# Altium schematic sheet Sheet1.SchDoc
size A2; SheetNumber: 1; SheetTotal: 1
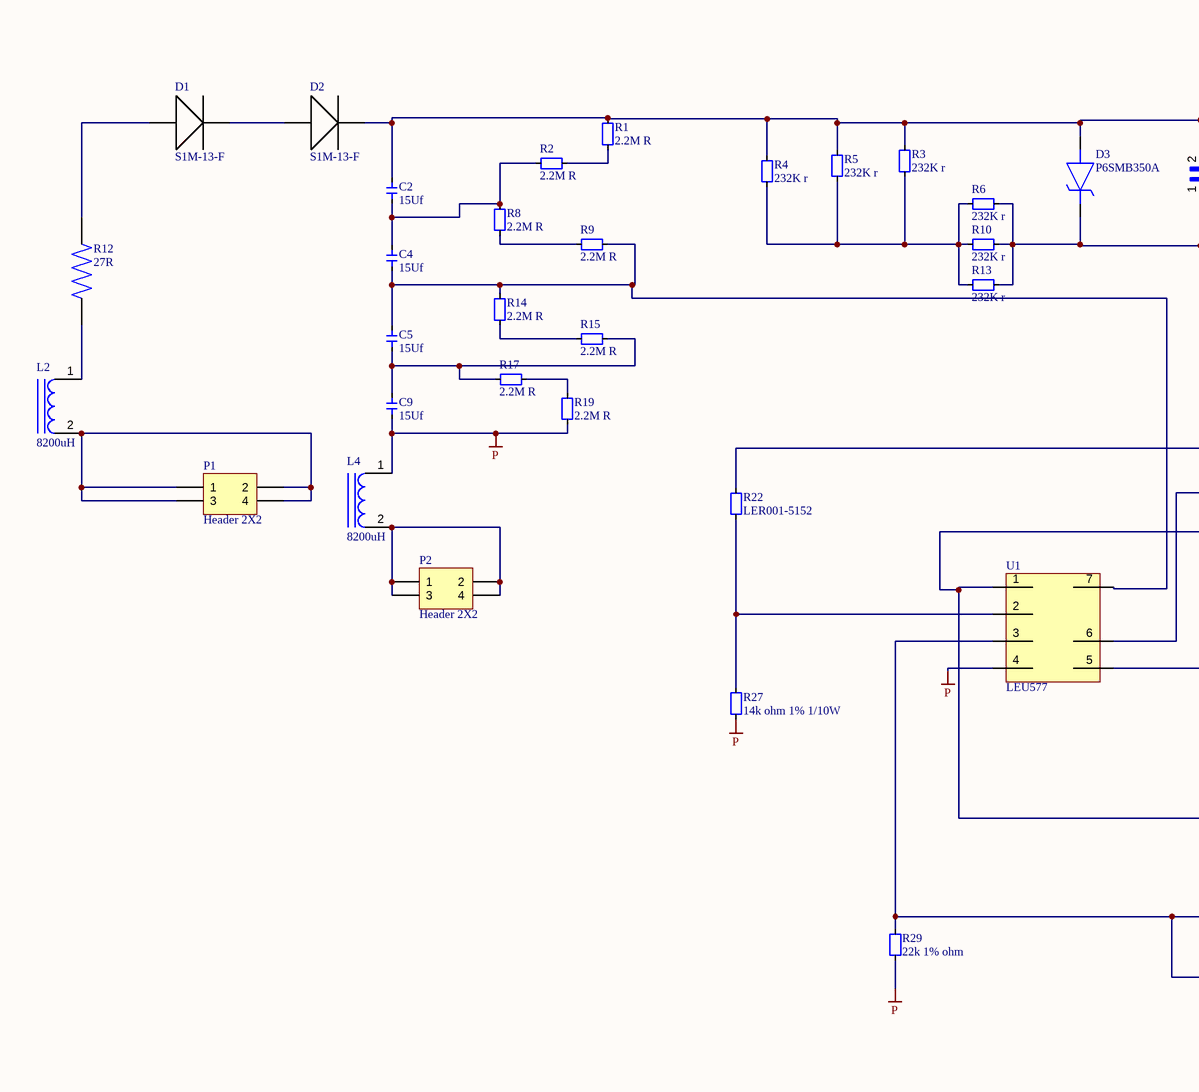
[diagram p0: Sheet1.SchDoc, left]
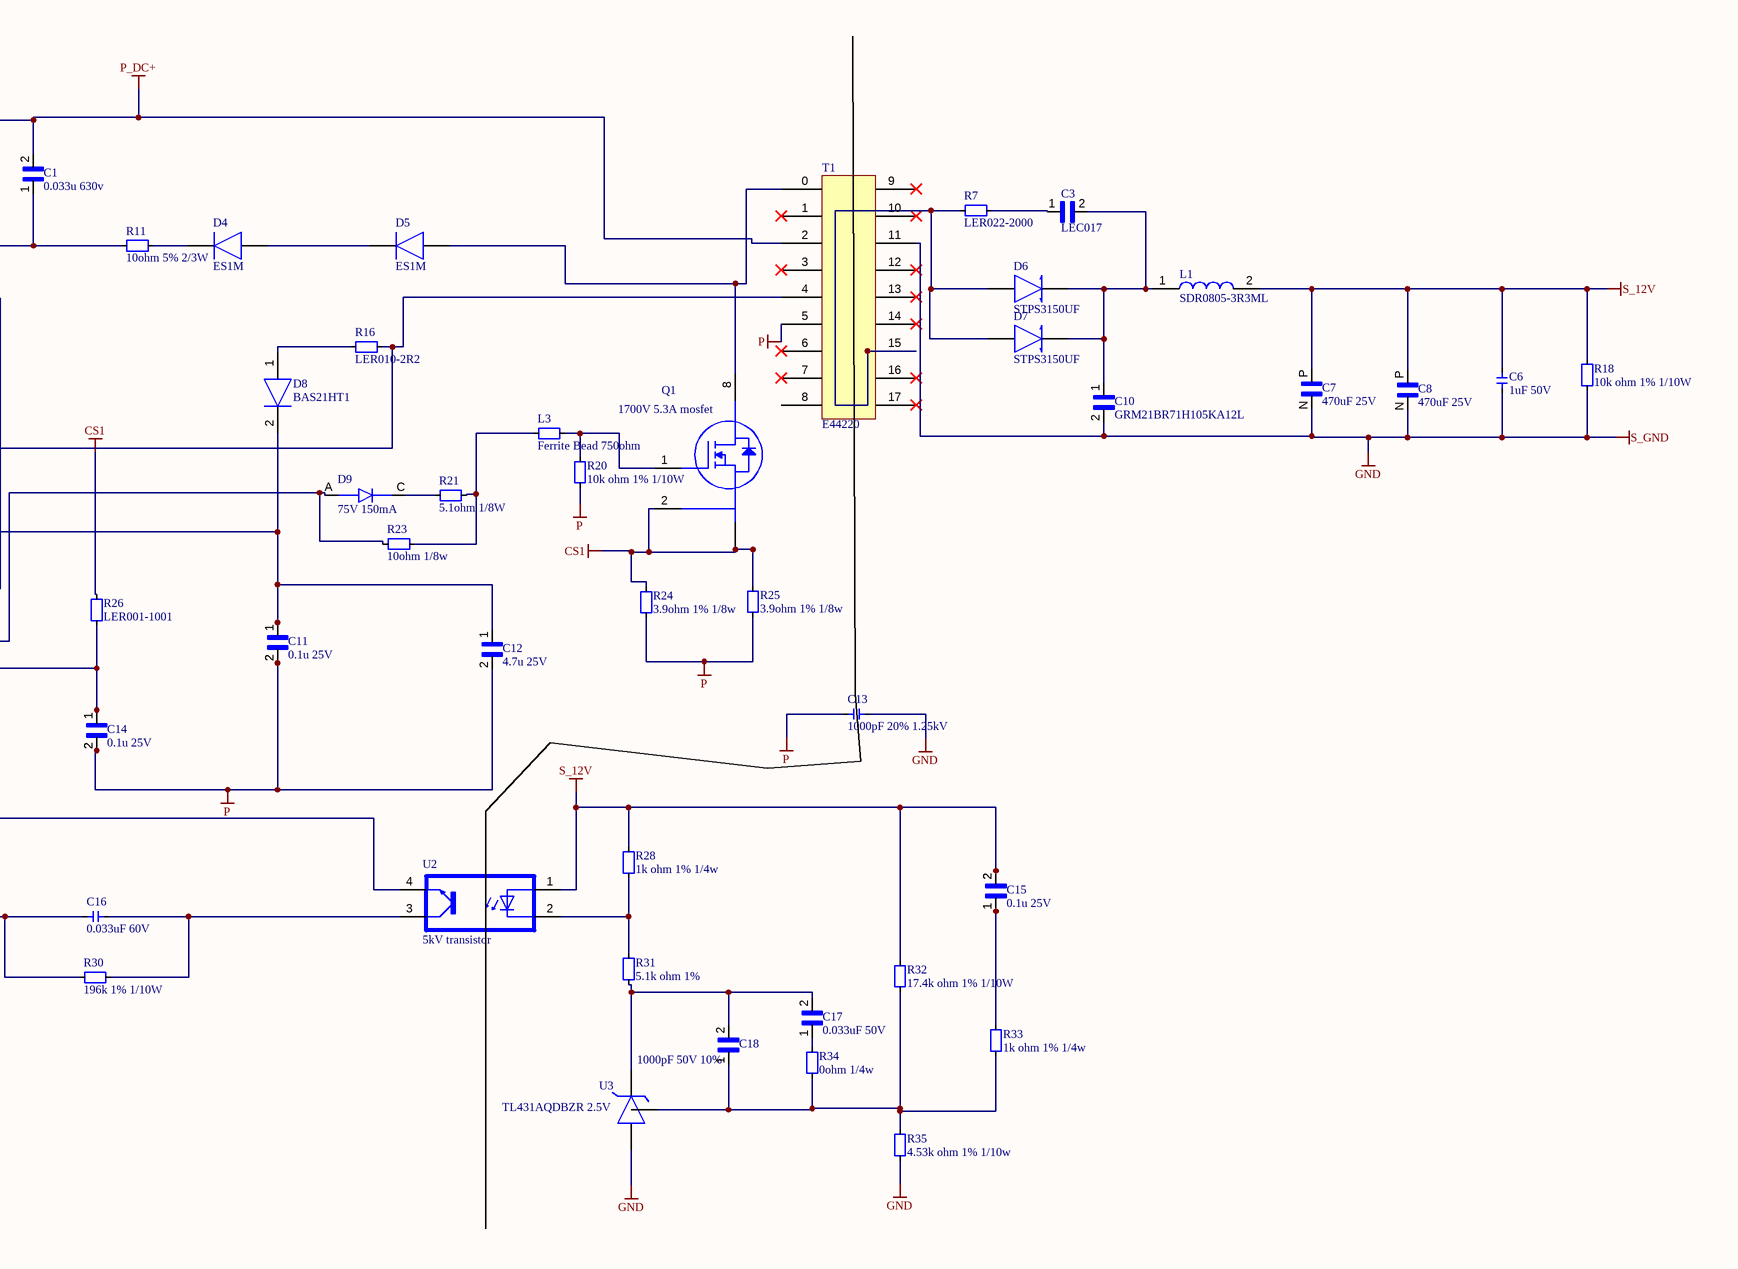
[diagram p1: Sheet1.SchDoc, right]

## Parts
C1  0.033u 630v  [0.33u 630V c]
C2  15Uf  [15uf]
C3  LEC017  [LEC017]
C4  15Uf  [15uf]
C5  15Uf  [15uf]
C6  1uF 50V  [C-0805]
C7  470uF 25V  [470uF 25V]
C8  470uF 25V  [470uF 25V]
C9  15Uf  [15uf]
C10  GRM21BR71H105KA12L  [CAPC2012X135N]
C11  0.1u 25V  [CAPC2012X135N]
C12  4.7u 25V  [4.7u 25V]
C13  1000pF 20% 1.25kV  [CAP Fılm 1000pF 20% 450V]
C14  0.1u 25V  [CAPC2012X135N]
C15  0.1u 25V  [CAPC2012X135N]
C16  0.033uF 60V  [C-0603]
C17  0.033uF 50V  [C-0603]
C18  1000pF 50V 10%  [C-0805]
D1  S1M-13-F  [S1M-13F]
D2  S1M-13-F  [S1M-13F]
D3  P6SMB350A  [P6SMB350A]
D4  ES1M  [ES1M]
D5  ES1M  [ES1M]
D6  STPS3150UF  [STPS3150UF]
D7  STPS3150UF  [STPS3150UF]
D8  BAS21HT1  [BAS21HT1]
D9  75V 150mA  [75V 150mA]
L1  SDR0805-3R3ML  [8200uH]
L2  8200uH  [8200uH]
L3  Ferrite Bead 750ohm  [Ferrite Bead 750ohm]
L4  8200uH  [8200uH]
P1  Header 2X2  [HDR2X2]
P2  Header 2X2  [HDR2X2]
Q1  1700V 5.3A mosfet  [1400V 5.3A Mosfet]
R1  2.2M R  [232K]
R2  2.2M R  [232K]
R3  232K r  [232K]
R4  232K r  [232K]
R5  232K r  [232K]
R6  232K r  [232K]
R7  LER022-2000  [LER022]
R8  2.2M R  [232K]
R9  2.2M R  [232K]
R10  232K r  [232K]
R11  10ohm 5% 2/3W  [10 ohm %5]
R12  27R  [75R2W]
R13  232K r  [232K]
R14  2.2M R  [232K]
R15  2.2M R  [232K]
R16  LER010-2R2  [LER010-2R2]
R17  2.2M R  [232K]
R18  10k ohm 1% 1/10W  [10k ohm 1%]
R19  2.2M R  [232K]
R20  10k ohm 1% 1/10W  [10k ohm 1%]
R21  5.1ohm 1/8W  [5.1 ohm 1/8w]
R22  LER001-5152  [LER001-5152]
R23  10ohm 1/8w  [5.1 ohm 1/8w]
R24  3.9ohm 1% 1/8w  [5.1 ohm 1/8w]
R25  3.9ohm 1% 1/8w  [5.1 ohm 1/8w]
R26  LER001-1001  [LER001-1001]
R27  14k ohm 1% 1/10W  [R-0603]
R28  1k ohm 1% 1/4w  [R-0603]
R29  22k 1% ohm  [R-0603]
R30  196k 1% 1/10W  [R-0603]
R31  5.1k ohm 1%  [R-0603]
R32  17.4k ohm 1% 1/10W  [R-0603]
R33  1k ohm 1% 1/4w  [R-0603]
R34  0ohm 1/4w  [R-0603]
R35  4.53k ohm 1% 1/10w  [R-0603]
T1  E44220  [E44220]
U1  LEU577  [LEU577]
U2  5kV transistor  [SOP-4]
U3  TL431AQDBZR 2.5V  [SOT95P237X112-3N]

## Nets
CS1: Q1.2(DRIVER_SOURCE) Q1.3(POWER_SOURCE) Q1.4(POWER_SOURCE) Q1.5(POWER_SOURCE) Q1.6(POWER_SOURCE) Q1.7(POWER_SOURCE) R24.2 R25.2 R26.2
GND: C6.2 C7.N C8.N C10.2 C13.2 R18.1 R35.1 T1.11 U3.1  [also labelled S_GND]
P: C9.P C11.2 C12.2 C13.1 C14.2 L4.1 R19.2 R20.1 R24.1 R25.1 R27.1 R29.1 T1.5 U1.4
P_DC+: C1.2 C2.N D2.A D3.A R1.2 R3.2 R4.2 R5.2 T1.2
S_12V: C6.1 C7.P C8.P C15.2 L1.2 R18.2 R28.2 R32.2 U2.1(A)
NetC1_1: C1.1 D3.C(K) R6.1 R10.1 R11.1 R13.1
NetC2_P: C2.P C4.N R2.2 R8.1
NetC3_1: C3.1 R7.2
NetC3_2: C3.2 C10.1 D6.C(K) D7.C(K) L1.1
NetC4_P: C4.P C5.N R9.1 R14.2 U1.7
NetC5_P: C5.P C9.N R15.1 R17.2
NetC11_1: C11.1 C12.1 D8.2(K) U1.1 U2.4(CO)
NetC14_1: C14.1 R26.1 U1.5
NetC15_1: C15.1 R33.2
NetC16_1: C16.1 R29.2 R30.1 U1.3
NetC16_2: C16.2 R30.2 U2.3(E)
NetC17_1: C17.1 R34.2
NetC17_2: C17.2 C18.2 R31.1 U3.3
NetC18_1: C18.1 R32.1 R33.1 R34.1 R35.2 U3.2
NetD1_A: D1.A D2.C
NetD1_C: D1.C R12.2
NetD4_A: D4.A D5.C
NetD4_C: D4.C R11.2
NetD5_A: D5.A Q1.8(DRAIN) T1.0
NetD6_A: D6.A D7.A R7.1 T1.15
NetD8_1: D8.1(A) R16.1
NetD9_A: D9.A R23.1 U1.6
NetD9_C: D9.C R21.2
NetL2_1: L2.1 R12.1
NetL2_2: L2.2 P1.1 P1.2 P1.3 P1.4
NetL3_1: L3.1 R21.1 R23.2
NetL3_2: L3.2 Q1.1(GATE) R20.2
NetL4_2: L4.2 P2.1 P2.2 P2.3 P2.4
NetR1_1: R1.1 R2.1
NetR3_1: R3.1 R4.1 R5.1 R6.2 R10.2 R13.2
NetR8_2: R8.2 R9.2
NetR14_1: R14.1 R15.2
NetR16_2: R16.2 R22.2 T1.4
NetR17_1: R17.1 R19.1
NetR22_1: R22.1 R27.2 U1.2
NetR28_1: R28.1 R31.2 U2.2(C)

Not connected (* = marked no-connect by the designer): T1 1* 3* 6(7)* 7* 8 9* 10* 12* 13* 14* 16* 17*

## Notes on the sheet
- DWG NO:
- REV:
- THIS DOCUMENT AND THE DATA DISCLOSED HEREIN OR
- HEREWITH IS THE PROPERTY OF ALTIUM LIMITED AND MAY
- BE FREELY DISTRIBUTED IN WHOLE. NO RIGHTS ARE
- RESERVED OR EXPRESS OR IMPLIED WARANTEE GIVEN.
- REVISION
- DESCRIPTION
- DATE
- APPROVED
- ENG:
- APPROVALS
- PROJECT
- DSN:
- CHK:
- REFERENCE DOCUMENTS
- PROJECT REVISION:
- TITLE
- DOCUMENT REVISION:
- DESIGN ITEM:
- BOM:
- FAB DWG:
- PCB DWG:
- ASSY DWG:
- SCALE:
- A2
- SIZE
- CAGE CODE
- FILE NAME
- DWG NO.
- SHEET
- OF
- REV

## Library data of the parts
C10 = GRM21BR71H105KA12L: SMD Capacitor X7R(EIA) with Capacitance: 1.0uF Tol. 10%. Rated Voltage: 50Vdc; MF: Murata; SnapEDA_Link: https://www.snapeda.com/parts/GRM21BR71H105KA12L/Murata%20Electronics%20North%20America/view-part/78633/?ref=snap; Availability: Warning; MP: GRM21BR71H105KA12L; Value: *; Price: None; Package: 0805 Murata; Check_prices: https://www.snapeda.com/parts/GRM21BR71H105KA12L/Murata%20Electronics%20North%20America/view-part/78633/?ref=eda
P1 P2 = Header 2X2: Header, 2-Pin, Dual row; LatestRevisionDate: 17-Jul-2002; LatestRevisionNote: Re-released for DXP Platform.; Publisher: Altium Limited